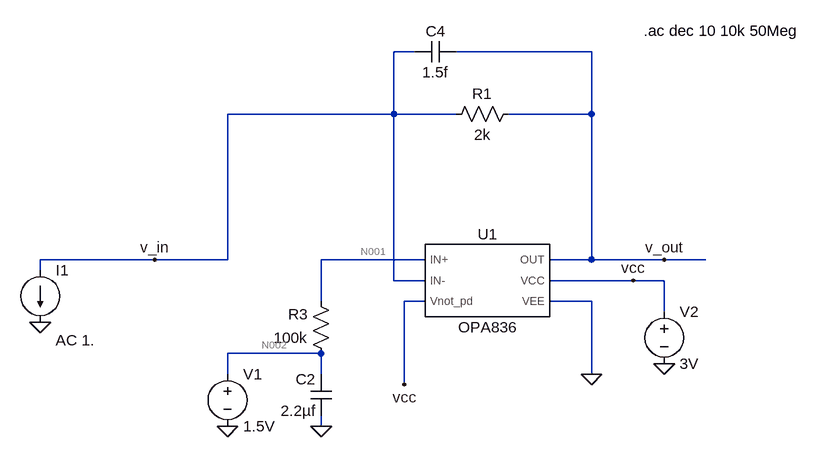
[diagram p0: schematic preamp_tia.asc]
preamp_tia.asc, the LTspice schematic file:
Version 4
SHEET 1 888 680
WIRE 96 -160 64 -160
WIRE 368 -160 160 -160
WIRE 64 -64 64 -160
WIRE 64 -64 -192 -64
WIRE 160 -64 64 -64
WIRE 368 -64 368 -160
WIRE 368 -64 240 -64
WIRE -304 160 -480 160
WIRE -192 160 -192 -64
WIRE -192 160 -304 160
WIRE 112 160 -48 160
WIRE 368 160 368 -64
WIRE 368 160 304 160
WIRE 480 160 368 160
WIRE 544 160 480 160
WIRE -480 176 -480 160
WIRE 64 192 64 -64
WIRE 112 192 64 192
WIRE 432 192 304 192
WIRE 480 192 432 192
WIRE -48 224 -48 160
WIRE 112 224 80 224
WIRE 368 224 304 224
WIRE 480 240 480 192
WIRE -48 304 -192 304
WIRE -192 336 -192 304
WIRE -48 336 -48 304
WIRE 368 336 368 224
WIRE 80 352 80 224
WIRE -48 416 -48 400
FLAG 480 320 0
FLAG 368 336 0
FLAG -192 416 0
FLAG 480 160 v_out
FLAG -48 416 0
FLAG 432 192 vcc
FLAG 80 352 vcc
FLAG -304 160 v_in
FLAG -480 256 0
SYMBOL res 256 -80 R90
WINDOW 0 0 56 VBottom 2
WINDOW 3 32 56 VTop 2
SYMATTR InstName R1
SYMATTR Value 2k
SYMBOL res -32 320 R180
WINDOW 0 36 76 Left 2
WINDOW 3 36 40 Left 2
SYMATTR InstName R3
SYMATTR Value 100k
SYMBOL voltage -192 320 R0
WINDOW 123 0 0 Left 0
WINDOW 39 0 0 Left 0
SYMATTR InstName V1
SYMATTR Value 1.5V
SYMBOL voltage 480 224 R0
WINDOW 123 0 0 Left 0
WINDOW 39 0 0 Left 0
SYMATTR InstName V2
SYMATTR Value 3V
SYMBOL cap -32 400 R180
WINDOW 0 24 56 Left 2
WINDOW 3 24 8 Left 2
SYMATTR InstName C2
SYMATTR Value 2.2µf
SYMBOL OPA836 208 192 R0
SYMATTR InstName U1
SYMBOL cap 160 -176 R90
WINDOW 0 0 32 VBottom 2
WINDOW 3 32 32 VTop 2
SYMATTR InstName C4
SYMATTR Value 1.5f
SYMBOL current -480 176 R0
WINDOW 123 24 108 Left 2
WINDOW 39 0 0 Left 0
SYMATTR InstName I1
SYMATTR Value ""
SYMATTR Value2 AC 1.
TEXT 448 -192 Left 2 !.ac dec 10 10k 50Meg

The netlist it stands for:
* preamp_tia.asc
R1 v_out v_in 2k
R3 N002 N001 100k
V1 N002 0 1.5V
V2 vcc 0 3V
C2 0 N002 2.2µf
XU1 N001 v_in v_out vcc 0 vcc OPA836  ; pins IN+ IN- OUT VCC VEE Vnot_pd
C4 v_out v_in 1.5f
I1 v_in 0 AC 1.
.ac dec 10 10k 50Meg
.lib C:\Users\serge\Documents\repos\wulpus_pro\ltspice_sim\wulpus_pro_rx\opa836_a.lib
.backanno
.end

* Results of the author's LTspice run, read from the files saved beside the schematic
* Operating Point, zero values left out:
*   V(v_out) = 1.458 V
*   V(v_in) = 1.457 V
*   V(n002) = 1.5 V
*   V(n001) = 1.457 V
*   V(vcc) = 3 V
*   I(R1) = 404 nA
*   I(R3) = 433.1 nA
*   I(V1) = -433.1 nA
*   I(V2) = -1.004 mA
*   Ix(u1:IN+) = 433.1 nA
*   Ix(u1:IN-) = 404 nA
*   Ix(u1:OUT) = -404 nA
*   Ix(u1:VCC) = 1.004 mA
*   Ix(u1:VEE) = -1.004 mA
*   Ix(u1:VNOT_PD) = 23 nA